# Altium schematic sheet audio.SchDoc
size A
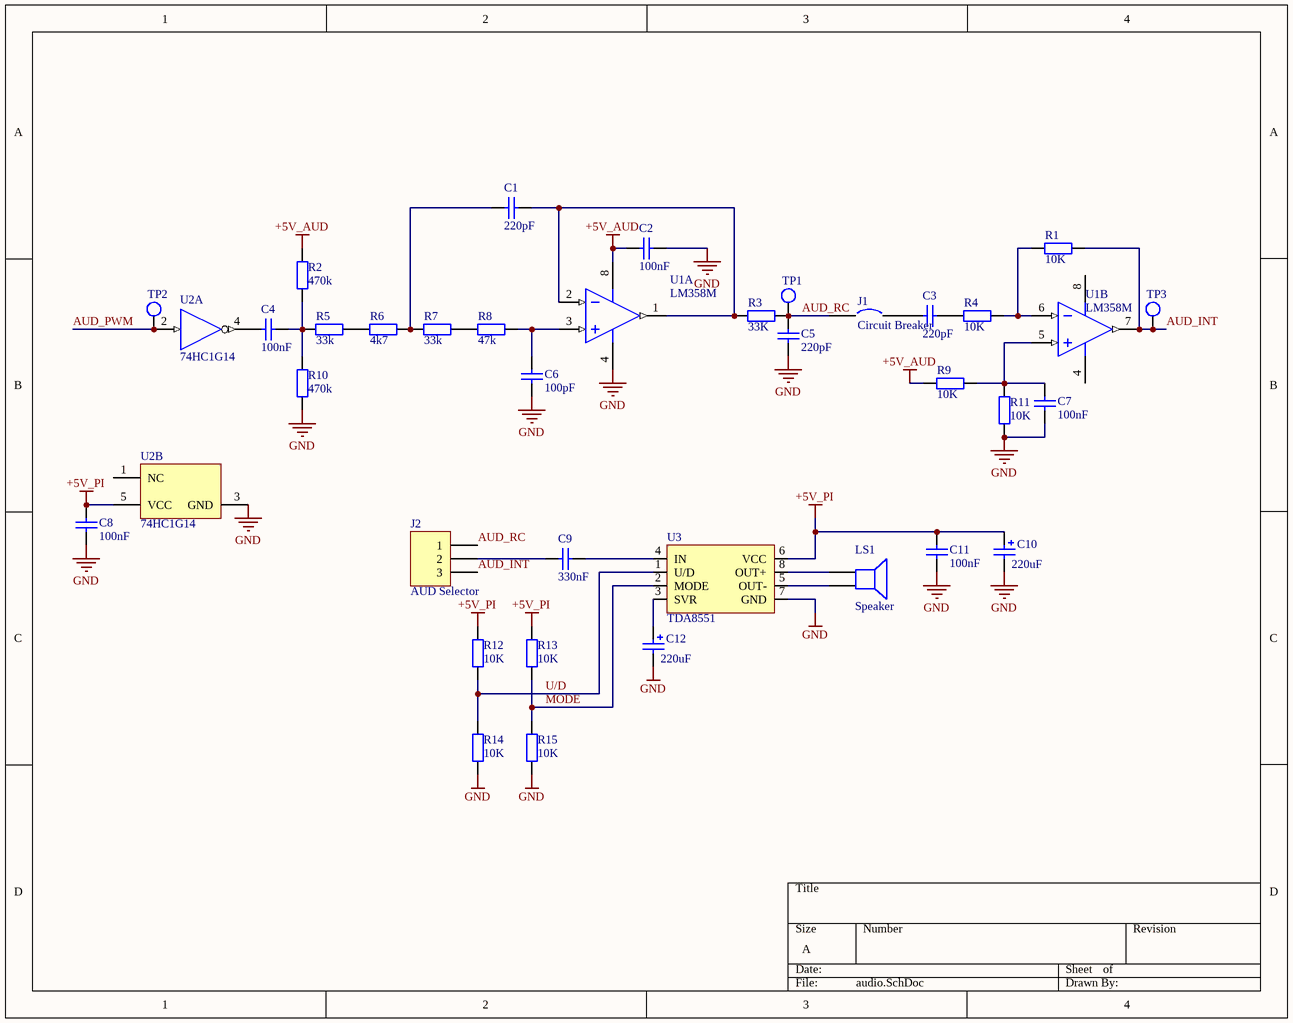
[diagram p0: audio.SchDoc]

## Parts
C1  value 220pF  [6-0805_M]  (hidden comment: Cap)
C2  value 100nF  [6-0805_M]  (hidden comment: Cap)
C3  value 220pF  [6-0805_M]  (hidden comment: Cap)
C4  value 100nF  [6-0805_M]  (hidden comment: Cap)
C5  value 220pF  [6-0805_M]  (hidden comment: Cap)
C6  value 100pF  [6-0805_M]  (hidden comment: Cap)
C7  value 100nF  [6-0805_M]  (hidden comment: Cap)
C8  value 100nF  [6-0805_M]  (hidden comment: Cap)
C9  value 330nF  [6-0805_M]  (hidden comment: Cap)
C10  value 220uF  [EEEFK1H]  (hidden comment: Cap Pol2)
C11  value 100nF  [6-0805_M]  (hidden comment: Cap)
C12  value 220uF  [EEEFK1H]  (hidden comment: Cap Pol2)
J1  Circuit Breaker  [SOLDER_JUMPER_24mil]
J2  AUD Selector  [SOLDER_SELECTOR_24mil]
LS1  Speaker  [HDR1X2]
R1  value 10K  [6-0805_M]  (hidden comment: Res2)
R2  value 470k  [6-0805_M]  (hidden comment: Res2)
R3  value 33K  [6-0805_M]  (hidden comment: Res2)
R4  value 10K  [6-0805_M]  (hidden comment: Res2)
R5  value 33k  [6-0805_M]  (hidden comment: Res2)
R6  value 4k7  [6-0805_M]  (hidden comment: Res2)
R7  value 33k  [6-0805_M]  (hidden comment: Res2)
R8  value 47k  [6-0805_M]  (hidden comment: Res2)
R9  value 10K  [6-0805_M]  (hidden comment: Res2)
R10  value 470k  [6-0805_M]  (hidden comment: Res2)
R11  value 10K  [6-0805_M]  (hidden comment: Res2)
R12  value 10K  [6-0805_M]  (hidden comment: Res2)
R13  value 10K  [6-0805_M]  (hidden comment: Res2)
R14  value 10K  [6-0805_M]  (hidden comment: Res2)
R15  value 10K  [6-0805_M]  (hidden comment: Res2)
TP1  TestPoint  [MEASUREMENT_POINT]  (value not drawn)
TP2  TestPoint  [MEASUREMENT_POINT]  (value not drawn)
TP3  TestPoint  [MEASUREMENT_POINT]  (value not drawn)
U1  LM358M  [M08A_N]  (parts A,B of 2)
U2  74HC1G14  [DBV0005A_N]  (parts A,B of 2)
U3  TDA8551  [SOIC-8]

## Nets
+5V_AUD: C2.2 R2.2 R9.1 U1.8(V+)
+5V_PI: C8.1 C10.1 C11.1 R12.2 R13.2 U2.5(VCC) U3.6(VCC)
GND: C2.1 C5.1 C6.2 C7.2 C8.2 C10.2 C11.2 C12.2 R10.1 R11.1 R14.1 R15.1 U1.4(GND) U2.3(GND) U3.7(GND)
AUD_INT: J2.3 R1.2 TP3.1 U1.7(OUTB)
AUD_PWM: TP2.1 U2.2(A)
AUD_RC: C5.2 J1.1 J2.1 R3.2 TP1.1
MODE: R13.1 R15.2 U3.2(MODE)
U/D: R12.1 R14.2 U3.1(U/D)
NetC1_1: C1.1 R3.1 U1.1(OUTA) U1.2(INA-)
NetC1_2: C1.2 R6.2 R7.1
NetC3_1: C3.1 R4.1
NetC3_2: C3.2 J1.2
NetC4_1: C4.1 R2.1 R5.1 R10.2
NetC4_2: C4.2 U2.4(Y)
NetC6_1: C6.1 R8.2 U1.3(INA+)
NetC7_1: C7.1 R9.2 R11.2 U1.5(INB+)
NetC9_1: C9.1 U3.4(IN)
NetC9_2: C9.2 J2.2
NetC12_1: C12.1 U3.3(SVR)
NetLS1_1: LS1.1 U3.8(OUT+)
NetLS1_2: LS1.2 U3.5(OUT-)
NetR1_1: R1.1 R4.2 U1.6(INB-)
NetR5_2: R5.2 R6.1
NetR7_2: R7.2 R8.1

Not connected (* = marked no-connect by the designer): U2 1(NC)

## Library data of the parts
C1-C9 C11 = Cap: Capacitor; Published: 8-Jun-2000; LatestRevisionDate: 17-Jul-2002; LatestRevisionNote: Re-released for DXP Platform.; PackageReference: RAD-0.3; Publisher: Altium Limited; PackageDescription: Radial Cap, Thru-Hole; 2 Leads; 0.3 in Pin Spacing
C10 C12 = Cap Pol2: Polarized Capacitor (Axial); Published: 8-Jun-2000; LatestRevisionDate: 17-Jul-2002; LatestRevisionNote: Re-released for DXP Platform.; PackageReference: POLAR0.8; Publisher: Altium Limited; PackageDescription: Polarized Capacitor; 2 Leads
J2 = Header 3: Header, 3-Pin; LatestRevisionDate: 17-Jul-2002; LatestRevisionNote: Re-released for DXP Platform.; Publisher: Altium Limited
LS1 = Speaker: Loudspeaker; Published: 24-Mar-1999; LatestRevisionDate: 17-Jul-2002; LatestRevisionNote: Re-released for DXP Platform.; PackageReference: PIN2; Publisher: Altium Limited
R1-R15 = Res2: Resistor; Published: 8-Jun-2000; LatestRevisionDate: 17-Jul-2002; LatestRevisionNote: Re-released for DXP Platform.; PackageReference: AXIAL-0.4; Publisher: Altium Limited; PackageDescription: Axial Device, Thru-Hole; 2 Leads; 0.4 in Pin Spacing
U1 = LM358M: Low Power Dual Operational Amplifier, 8-pin Narrow SOIC; Manufacturer: National Semiconductor; PackageTopMarking: NSZXTT*LM*358M; PowerWise: N; CompType: Amplifiers; High-Reliability: Y; DatasheetVersion: Oct-2005; PackageVersion: revM, May-2009; PackageReference: M08A; PackageDescription: SOIC Narrow, 4.9 x 3.9 x 1.45mm, 8 Lead, 1.27mm Pitch; PartNumber: LM358M; RoHS: N; PinCount: 8; Code_JEDEC: MS-012-AA; Code_IPC: SOIC127P600-8; ComponentLink1Description: Manufacturer URL; ComponentLink1URL: http://www.national.com/; ComponentLink2Description: LM358 Datasheet; ComponentLink2URL: http://www.national.com/ds/LM/LM358.pdf; ComponentLink3Description: LM358 Web Page; ComponentLink3URL: http://www.national.com/pf/LM/LM358.html; ComponentLink4Description: M08A Package Page; ComponentLink4URL: http://www.national.com/packaging/folders/m08a.html
U2 = SN74AHC1G14DBVT: Single Schmitt-Trigger Inverter Gate, DBV0005A, SMALL T&R; Manufacturer: Texas Instruments; VCC(Min)(V): 2; VCC(Max)(V): 5.5; Output Type: CMOS; ICC @ Nom Voltage(Max)(mA): 0.01; Bits(#): 1; F @ Nom Voltage(Max)(Mhz): 75; Rating: Catalog; Technology Family: AHC; Voltage(Nom)(V): 3.3,5; Schmitt Trigger: Yes; Output Drive (IOL/IOH)(Max)(mA): 50/-50; tpd @ Nom Voltage(Max)(ns): 16.3,10.6; Logic: Inverting; Sub-Family: Inverting Buffer/Driver; 3-State Output: No; DatasheetVersion: SCLS321P; PackageReference: DBV0005A; Supplier 1: Mouser; Supplier Part Number 1: 595-SN74AHC1G14DBVT; Supplier 2: Digi-Key; Supplier Part Number 2: 296-26401-2-ND; Supplier 3: Digi-Key; Supplier Part Number 3: 296-26401-1-ND; Supplier 4: Digi-Key; Supplier Part Number 4: 296-26401-6-ND; Generic Part Number: SN74AHC1G14; Input Type: CMOS; Operating Temperature Range(C): -40 to 125; PartNumber: SN74AHC1G14DBVT; ComponentLink1Description: Manufacturer URL; ComponentLink1URL: http://www.ti.com/; ComponentLink2Description: Datasheet; ComponentLink2URL: http://www.ti.com/lit/ds/symlink/sn74ahc1g14.pdf
U3 = TDA8551: TDA8551 1W Audio Amplifier
J1 = Circuit Breaker: Published: 24-Mar-1999; LatestRevisionDate: 17-Jul-2002; LatestRevisionNote: Re-released for DXP Platform.; PackageReference: SPST-2; Publisher: Altium Limited; PackageDescription: Switch; 2 Leads